# EAGLE design NinoTNC BLE (EAGLE 9.5.2)
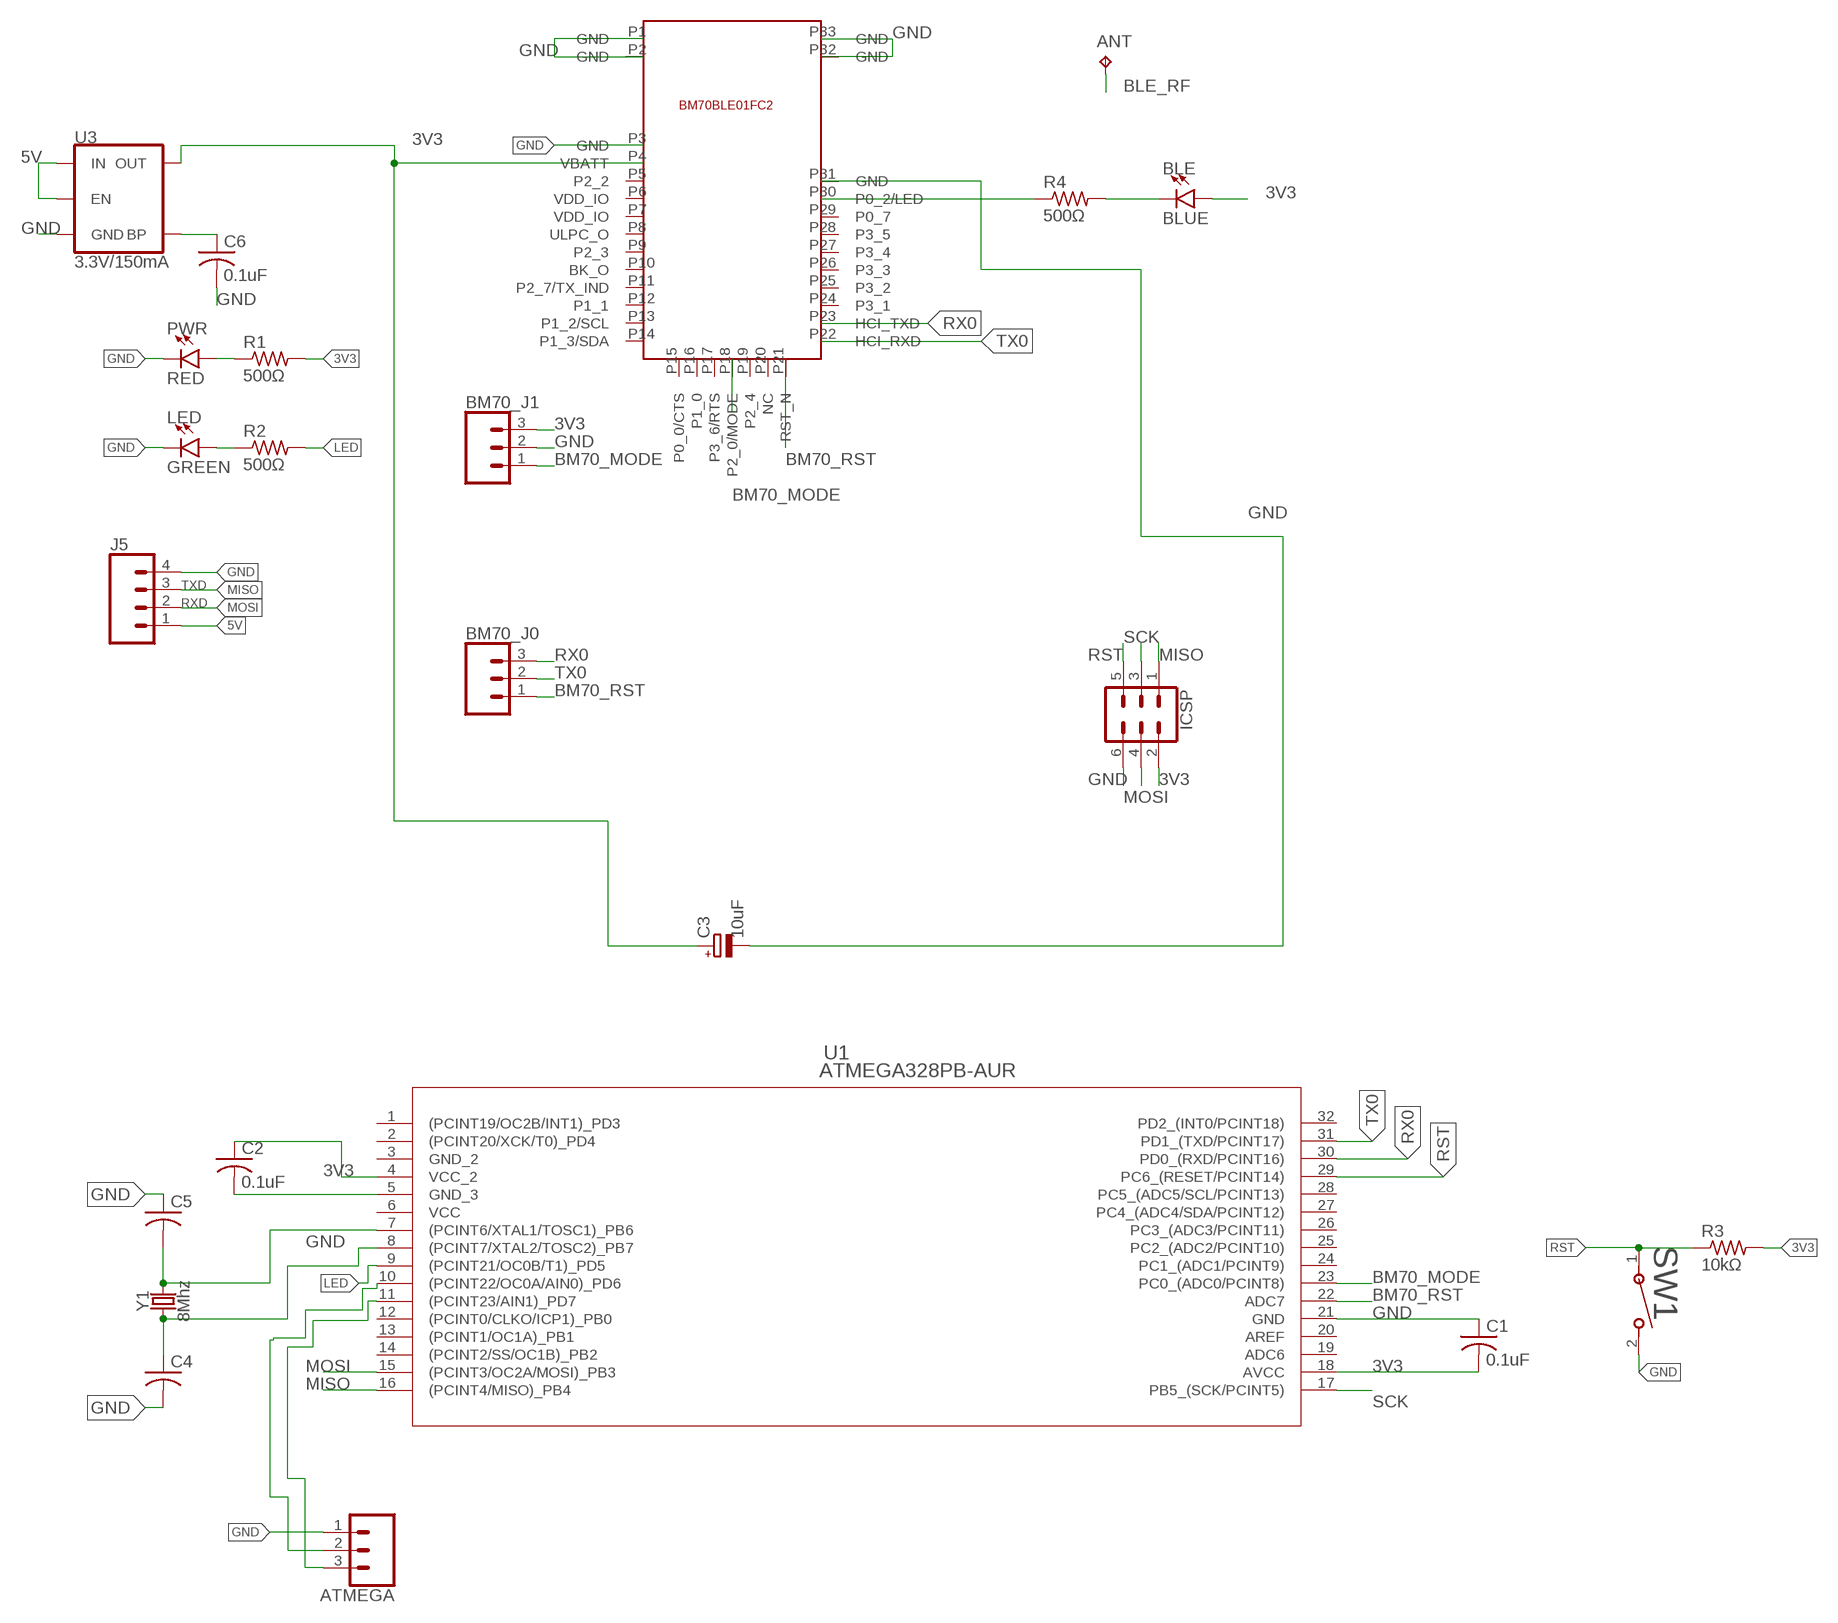
[diagram p0: schematic, sheet 1]

## Parts
ANT  TPTP08SQ  [TP08SQ]
ATMEGA  CONN_03  [1X03]
BLE  BLUE  LED-RED0603  [LED-0603]
BM70_J0  CONN_03  [1X03]
BM70_J1  CONN_03  [1X03]
C1  0.1uF  C-USC0805  [C0805]
C2  0.1uF  C-USC0805  [C0805]
C3  10uF  CAPACITOR_POL-SMC_A  [SMC_A]
C4  22pF  C-USC0805  [C0805]
C5  22pF  C-USC0805  [C0805]
C6  0.1uF  C-USC0805  [C0805]
ICSP  CONN_03X22X3_SILK_MALE_PTH  [2X3]
J5  CONN_04  [1X04]
LED  GREEN  LED-RED0603  [LED-0603]
PWR  RED  LED-RED0603  [LED-0603]
R1  500Ω  R-US_M0805  [M0805]
R2  500Ω  R-US_M0805  [M0805]
R3  10kΩ  R-US_R0805  [R0805]
R4  500Ω  R-US_M0805  [M0805]
SW1  EVQ-PE105K  [EVQPE_5_PAN]
U1  ATMEGA328PB-AUR  [32A_MCH]
U3  3.3V/150mA  V_REG_MIC52053.3V  [SOT23-5]
U$1  BM70BLE01FC2  [BM70BLE01FC2]
Y1  8Mhz  CRYSTALPTH-HC49UV  [HC49U]

## Nets
3V3: BLE.A BM70_J1.3 C1.2 C2.1 C3.+ ICSP.2 R1.2 R3.2 U1.4(VCC_2) U1.18(AVCC) U3.5(OUT) U$1.P4(VBATT)
5V: J5.1 U3.1(IN) U3.3(EN)
BLE_RF: ANT.TP
BM70_MODE: BM70_J1.1 U1.23(PC0_(ADC0/PCINT8)) U$1.P18(P2_0/MODE)
BM70_RST: BM70_J0.1 U1.22(ADC7) U$1.P21(RST_N)
GND: ATMEGA.1 BM70_J1.2 C1.1 C2.2 C3.- C4.2 C5.1 C6.2 ICSP.6 J5.4 LED.C PWR.C SW1.2 U1.5(GND_3) U1.21(GND) U3.2(GND) U$1.P1(GND) U$1.P2(GND) U$1.P3(GND) U$1.P31(GND) U$1.P32(GND) U$1.P33(GND)
LED: R2.2 U1.9((PCINT21/OC0B/T1)_PD5)
MISO: ICSP.1 J5.3 U1.16((PCINT4/MISO)_PB4)
MOSI: ICSP.4 J5.2 U1.15((PCINT3/OC2A/MOSI)_PB3)
N$1: R4.1 U$1.P30(P0_2/LED)
N$2: BLE.C R4.2
N$3: ATMEGA.3 U1.11((PCINT23/AIN1)_PD7)
N$4: C5.2 U1.7((PCINT6/XTAL1/TOSC1)_PB6) Y1.2
N$5: C4.1 U1.8((PCINT7/XTAL2/TOSC2)_PB7) Y1.1
N$6: PWR.A R1.1
N$7: LED.A R2.1
N$8: ATMEGA.2 U1.10((PCINT22/OC0A/AIN0)_PD6)
N$9: C6.1 U3.4(BP)
RST: ICSP.5 R3.1 SW1.1 U1.29(PC6_(RESET/PCINT14))
RX0: BM70_J0.3 U1.30(PD0_(RXD/PCINT16)) U$1.P23(HCI_TXD)
SCK: ICSP.3 U1.17(PB5_(SCK/PCINT5))
TX0: BM70_J0.2 U1.31(PD1_(TXD/PCINT17)) U$1.P22(HCI_RXD)
Unconnected: U1.1((PCINT19/OC2B/INT1)_PD3) U1.2((PCINT20/XCK/T0)_PD4) U1.12((PCINT0/CLKO/ICP1)_PB0) U1.13((PCINT1/OC1A)_PB1) U1.14((PCINT2/SS/OC1B)_PB2) U1.19(ADC6) U1.20(AREF) U1.24(PC1_(ADC1/PCINT9)) U1.25(PC2_(ADC2/PCINT10)) U1.26(PC3_(ADC3/PCINT11)) U1.27(PC4_(ADC4/SDA/PCINT12)) U1.28(PC5_(ADC5/SCL/PCINT13)) U1.32(PD2_(INT0/PCINT18)) U$1.P5(P2_2) U$1.P6(VDD_IO) U$1.P7(VDD_IO) U$1.P8(ULPC_O) U$1.P9(P2_3) U$1.P10(BK_O) U$1.P11(P2_7/TX_IND) U$1.P12(P1_1) U$1.P13(P1_2/SCL) U$1.P14(P1_3/SDA) U$1.P15(P0_0/CTS) U$1.P16(P1_0) U$1.P17(P3_6/RTS) U$1.P19(P2_4) U$1.P20(NC) U$1.P24(P3_1) U$1.P25(P3_2) U$1.P26(P3_3) U$1.P27(P3_4) U$1.P28(P3_5) U$1.P29(P0_7)

## Notes on the sheet
- TXD
- RXD

## Power pins joined to a net without a drawn wire
GND_2: U1.3(GND_2)
VCC: U1.6(VCC)

## Library data of the parts
ANT = testpad:TP: Test pad
ATMEGA BM70_J0 BM70_J1 = SparkFun-Connectors:CONN_03: Multi connection point. Often used as Generic Header-pin footprint for 0.1 inch spaced/style header connections On any of the 0.1 inch spaced packages, you can populate with these: Break Away Headers - Straight <https://www.sparkfun.com/products/116> (PRT-00116) Break Away Male Headers - Right Angle <https://www.sparkfun.com/products/553> (PRT-00553) Female Headers <https://www.sparkfun.com/products/115> (PRT-00115) Break Away Headers - Machine Pin <https://www.sparkfun.com/products/117> (PRT-00117) Break Away Female Headers - Swiss Machine Pin <https://www.sparkfun.com/products/743> (PRT-00743) Stackable Header - 3 Pin (Female, 0.1") <https://www.sparkfun.com/products/13875> (PRT-13875) For SCREWTERMINALS and SPRING TERMINALS visit here: Screw Terimnals on SparkFun.com <https://www.sparkfun.com/search/results?term=Screw+Terminals> (5mm/3.5mm/2.54mm spacing) This device is also useful as a general connection point to wire up your design to another part of your project. Our various solder wires solder well into these plated through hole pads. Hook-Up Wire - Assortment (Stranded, 22 AWG) <https://www.sparkfun.com/products/11375> (PRT-11375) Hook-Up Wire - Assortment (Solid Core, 22 AWG) <https://www.sparkfun.com/products/11367> (PRT-11367) View the entire wire category on our website here <https://www.sparkfun.com/categories/141> Special notes: Molex polarized connector foot print use with SKU : PRT-08232 with associated crimp pins and housings.
BLE LED = SparkFun-LED:LED-RED: Red SMD LED Used in manufacturing of most products at SparkFun Packages: 0603 - SMD 0603 package [Product Link] <http://docs.avagotech.com/docs/AV02-0551EN> 0603 SMART - SMD 0603 SMART package ( more efficient and expensive)[Product Link] <http://www.osram-os.com/Graphics/XPic2/00077099_0.pdf> 1206 - SMD1206 package [Product Link] <https://www.sparkfun.com/datasheets/DevTools/LilyPad/Q150OVS4.pdff> SparkFun Products: Pro Mini 328 -5V <https://www.sparkfun.com/products/821> RedBoard <https://www.sparkfun.com/products/12757> IOIO-OTG <https://www.sparkfun.com/products/13613>; PROD_ID: DIO-00819; VALUE: RED
C1 C2 C4-C6 = adafruit:C-US: CAPACITOR, American symbol
C3 = dp_devices:CAPACITOR_POL: Polarized capacitor in various packages
ICSP = SparkFun-Connectors:CONN_03X2: Multi connection point. Often used as Generic Header-pin footprint for 0.1 inch spaced/style header connections You can populate with any combo of single row headers, but if you'd like an exact match, check these: Header - 2x3 (Male, 0.1") <https://www.sparkfun.com/products/12807> (PRT-12807) Header - 2x3 (Female, 0.1") <https://www.sparkfun.com/products/13010> (PRT-13010) 2x3 Pin Shrouded Header <https://www.sparkfun.com/products/10877> (PRT-10877) On any of the 0.1 inch spaced packages, you can populate with these: Break Away Headers - Straight <https://www.sparkfun.com/products/116> (PRT-00116) Break Away Male Headers - Right Angle <https://www.sparkfun.com/products/553> (PRT-00553) Female Headers <https://www.sparkfun.com/products/115> (PRT-00115) Break Away Headers - Machine Pin <https://www.sparkfun.com/products/117> (PRT-00117) Break Away Female Headers - Swiss Machine Pin <https://www.sparkfun.com/products/743> (PRT-00743) Special note: the shrouded connector mates well with our 3x2 ribbon cables: Ribbon Crimp Connector - 6-pin (2x3, Female) <https://www.sparkfun.com/products/10651> (PRT-10651) Ribbon Cable - 6 wire (15ft) <https://www.sparkfun.com/products/10646> (PRT-10646); PROD_ID: CONN-09701
J5 = SparkFun-Connectors:CONN_04: Multi connection point. Often used as Generic Header-pin footprint for 0.1 inch spaced/style header connections On any of the 0.1 inch spaced packages, you can populate with these: Break Away Headers - Straight <https://www.sparkfun.com/products/116> (PRT-00116) Break Away Male Headers - Right Angle <https://www.sparkfun.com/products/553> (PRT-00553) Female Headers <https://www.sparkfun.com/products/115> (PRT-00115) Break Away Headers - Machine Pin <https://www.sparkfun.com/products/117> (PRT-00117) Break Away Female Headers - Swiss Machine Pin <https://www.sparkfun.com/products/743> (PRT-00743) For SCREWTERMINALS and SPRING TERMINALS visit here: Screw Terimnals on SparkFun.com <https://www.sparkfun.com/search/results?term=Screw+Terminals> (5mm/3.5mm/2.54mm spacing) This device is also useful as a general connection point to wire up your design to another part of your project. Our various solder wires solder well into these plated through hole pads. Hook-Up Wire - Assortment (Stranded, 22 AWG) <https://www.sparkfun.com/products/11375> (PRT-11375) Hook-Up Wire - Assortment (Solid Core, 22 AWG) <https://www.sparkfun.com/products/11367> (PRT-11367) View the entire wire category on our website here <https://www.sparkfun.com/categories/141> Special notes: Molex polarized connector foot print use with SKU : PRT-08231 with associated crimp pins and housings. 1MM SMD Version SKU: PRT-10208; PROD_ID: CONN-09696
PWR = SparkFun-LED:LED-RED: Red SMD LED Used in manufacturing of most products at SparkFun Packages: 0603 - SMD 0603 package [Product Link] <http://docs.avagotech.com/docs/AV02-0551EN> 0603 SMART - SMD 0603 SMART package ( more efficient and expensive)[Product Link] <http://www.osram-os.com/Graphics/XPic2/00077099_0.pdf> 1206 - SMD1206 package [Product Link] <https://www.sparkfun.com/datasheets/DevTools/LilyPad/Q150OVS4.pdff> SparkFun Products: Pro Mini 328 -5V <https://www.sparkfun.com/products/821> RedBoard <https://www.sparkfun.com/products/12757> IOIO-OTG <https://www.sparkfun.com/products/13613>; PROD_ID: DIO-00819
R1-R4 = adafruit:R-US_: RESISTOR, American symbol
SW1 = EVQ-PE105K:EVQ-PE105K; BUILT_BY: EMA_Cory; COPYRIGHT: Copyright (C) 2018 Accelerated Designs. All rights reserved; MANUFACTURER_PART_NUMBER: EVQ-PE105K; SOURCELIBRARY: Panasonic_2019-12-05; VENDOR: Panasonic
U1 = ATMEGA328PB-AUR:ATMEGA328PB-AUR; BUILT_BY: EMA_Molly; COPYRIGHT: Copyright (C) 2018 Accelerated Designs. All rights reserved; MANUFACTURER_PART_NUMBER: ATMEGA328PB-AUR; SOURCELIBRARY: Microchip_2019-09-03; VENDOR: Microchip
U3 = SparkFun-IC-Power:V_REG_MIC5205: V_REG MIC5205 Standard 3.3V, 5V, and Adjustable 150mA LDO voltage regulator in SOT-23 layout. Micrel part MIC5205. BP (by-pass) pin is used to lower output noise with 470pF cap, may be left open. On the adjustable version BP is used to set output.; PROD_ID: VREG-00822
U$1 = BM70:BM70BLE01FC2
Y1 = SparkFun-Clocks:CRYSTAL: Crystals (Generic) These are passive quartz crystals, which can be used as a clock source for a microcontroller. Crystal's are two-terminal devices. They require external "load" capacitors to generate an oscillating signal.

## Board
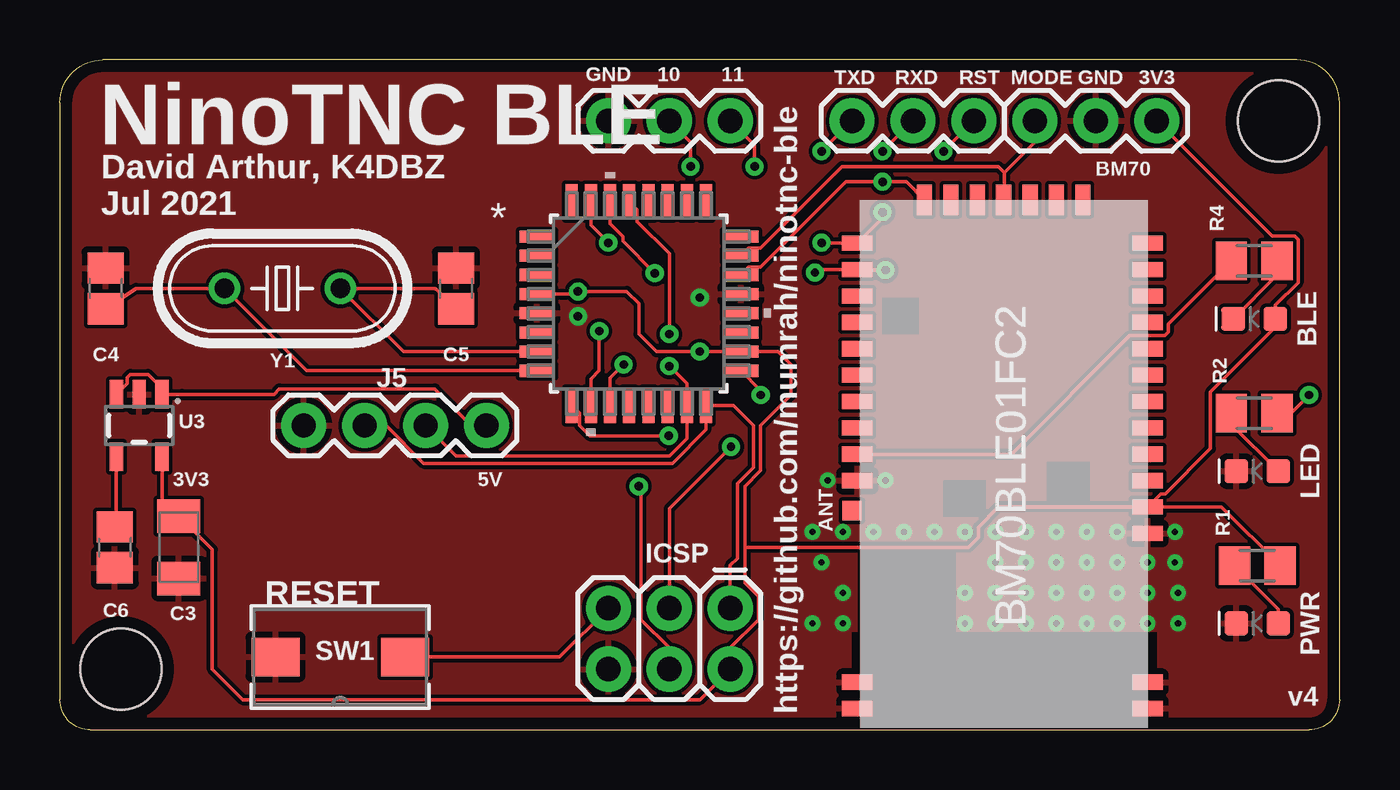
[diagram p1: board, top side]
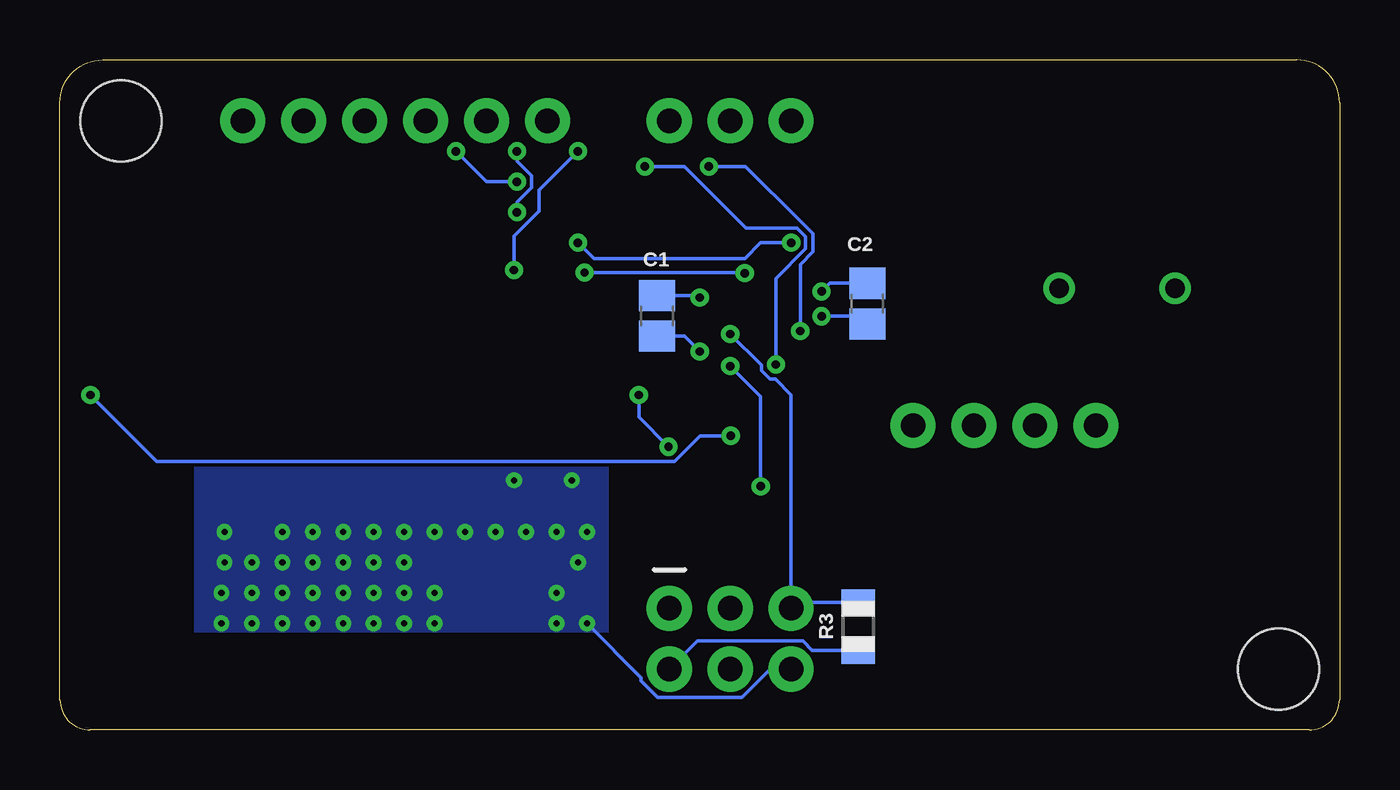
[diagram p2: board, bottom side, seen from below]

Size 53.34 x 27.94 mm. Coordinates in mm from the lower left corner, seen from the top.
Outline: 1.27,0 52.07,0 arc90 53.34,1.27 53.34,26.16 arc90 51.56,27.94 1.78,27.94 arc90 0,26.16 0,1.27 arc90 1.27,0
Copper layers (1*16): Top 0.035mm / dielectric 1.5mm / Bottom 0.035mm
Design rules "default *": minimum track width 6mil, minimum drill 10mil, track to track 6mil, track to pad 6mil, pad to pad 6mil, via to via 6mil, smd to smd 6mil, copper to edge 20mil, drill to drill 6mil, minimum pad ring 10mil, minimum via ring 8mil, stop-mask expansion 4mil, vias tented up to drill 20mil, thermal gap 10mil
Holes 3.38 mm at 2.54,2.54 50.8,25.4
tRestrict: area 33,0 to 45.7,4.1; area 33.3,4.1 to 37.3,7.4; area 36.8,8.9 to 38.6,10.4; area 41.1,9.4 to 42.9,11.2; area 34.3,16.5 to 35.8,18

### Footprints (pad centres in the part's own frame; a part is rotated, then mirrored left to right if it is on the bottom)
TP08SQ = smd 0.8 x 0.8: TP 0,0
1X03 = drill 1.016 pad 1.88: 1 0,0; 2 2.54,0; 3 5.08,0
LED-0603 = smd 1 x 1: A -0.877,0; C 0.877,0
C0805 = smd 1.3 x 1.5: 1 -0.85,0; 2 0.85,0
SMC_A = smd 1.4 x 1.8: + -1.3,0; - 1.3,0
2X3 = drill 1.016 pad 1.88: 1 0,0; 2 0,2.54; 3 2.54,0; 4 2.54,2.54; 5 5.08,0; 6 5.08,2.54
1X04 = drill 1.016 pad 1.88: 1 0,0; 2 2.54,0; 3 5.08,0; 4 7.62,0
M0805 = smd 1.3 x 1.6: 1 -0.95,0; 2 0.95,0
R0805 = smd 1.1 x 1.4: 1 -1,0; 2 1,0
EVQPE_5_PAN = smd 2.007 x 1.6: 1 -2.7,0; 2 2.7,0
32A_MCH = smd 1.461 x 0.501: 1 -4.25,2.8; 2 -4.25,2; 3 -4.25,1.2; 4 -4.25,0.4; 5 -4.25,-0.4; 6 -4.25,-1.2; 7 -4.25,-2; 8 -4.25,-2.8; 17 4.25,-2.8; 18 4.25,-2; 19 4.25,-1.2; 20 4.25,-0.4; 21 4.25,0.4; 22 4.25,1.2; 23 4.25,2; 24 4.25,2.8 | smd 0.501 x 1.461: 9 -2.8,-4.25; 10 -2,-4.25; 11 -1.2,-4.25; 12 -0.4,-4.25; 13 0.4,-4.25; 14 1.2,-4.25; 15 2,-4.25; 16 2.8,-4.25; 25 2.8,4.25; 26 2,4.25; 27 1.2,4.25; 28 0.4,4.25; 29 -0.4,4.25; 30 -1.2,4.25; 31 -2,4.25; 32 -2.8,4.25
SOT23-5 = smd 0.55 x 1.2: 1 -0.95,-1.3; 2 0,-1.3; 3 0.95,-1.3; 4 0.95,1.3; 5 -0.95,1.3
BM70BLE01FC2 = smd 1.27 x 0.635: P1 0,21.2; P2 0,20.1; P3 0,13.9; P4 0,12.8; P5 0,11.7; P6 0,10.6; P7 0,9.5; P8 0,8.4; P9 0,7.3; P10 0,6.2; P11 0,5.1; P12 0,4; P13 0,2.9; P14 0,1.8; P22 12.1,1.8; P23 12.1,2.9; P24 12.1,4; P25 12.1,5.1; P26 12.1,6.2; P27 12.1,7.3; P28 12.1,8.4; P29 12.1,9.5; P30 12.1,10.6; P31 12.1,11.7; P32 12.1,20.1; P33 12.1,21.2 | smd 0.635 x 1.27: P15 2.7,0; P16 3.8,0; P17 4.9,0; P18 6,0; P19 7.1,0; P20 8.2,0; P21 9.3,0
HC49U = drill 0.813: 1 -2.413,0; 2 2.413,0

### Placement (x,y rotation side)
ANT  33.02,9.14 0 top
ATMEGA  22.86,25.4 0 top
BLE  49.78,17.14 180 top
BM70_J0  38.1,25.4 180 top
BM70_J1  40.64,25.4 0 top
C1  28.45,17.27 270 bottom
C2  19.68,17.78 270 bottom
C3  4.95,7.62 270 top
C4  1.91,18.41 90 top
C5  16.51,18.41 270 top
C6  2.29,7.62 270 top
ICSP  27.94,5.08 180 top
J5  17.78,12.7 180 top
LED  49.91,10.79 180 top
PWR  49.91,4.45 180 top
R1  49.91,6.86 0 top
R2  49.78,13.21 0 top
R3  20.07,4.32 270 bottom
R4  49.78,19.56 0 top
SW1  11.68,3.05 180 top
U1  24.13,17.78 0 top
U3  3.3,12.7 180 top
U$1  45.34,22.1 180 top
Y1  9.27,18.41 0 top

### Tracks (layer width: path | path; a pad name or v marks a point on that pad's centre or on a via)
3V3  (via drill 0.35)
  Top 0.152: U1.4 21.48,18.18 v21.59,18.29 23.62,18.29 24.13,17.78 24.13,16.51 24.86,15.78 v26.67,15.78 U1.18 29.94,15.78 30.48,15.24 30.48,13.97 29.21,12.7 29.21,10.82 28.55,10.16 28.55,7.62 | 28.55,7.62 28.55,6.13 29.11,5.56 29.11,4.6 27.94,3.43 ICSP.2 26.67,1.27 7.62,1.27 6.35,2.54 6.35,7.52 C3.+ 4.25,9.62 U3.5 | U$1.P4 39.12,9.3 38.28,8.45 38.28,8.02 37.87,7.62 28.55,7.62 | U$1.P4 45.89,9.85 46.07,9.85 47.95,11.74 47.95,14.1 50.66,16.81 BLE.A 50.66,17.71 51.61,18.66 51.61,20.45 51.48,20.59 50.53,20.59 BM70_J1.3 | U$1.P4 48.42,9.3 R1.2
  Bottom 0.152: v21.59,18.29 21.25,18.63 C2.1 | C1.2 27.31,16.42 v26.67,15.78 | R3.2 21.99,3.32 22.38,3.71 26.77,3.71 ICSP.2
5V
  Top 0.152: J5.1 17.14,12.7 15.62,14.22 9.14,14.22 8.92,14 5.08,14 4.5,14 | U3.1 4.5,14 | U3.3 2.8,14.45 2.8,14.7 2.93,14.83 3.67,14.83 4.5,14
BM70_MODE
  Top 0.152: U1.23 28.7,20.1 29.2,20.1 32.6,23.5 39.12,23.5 39.37,23.24 | 39.37,23.24 39.37,22.13 U$1.P18 | BM70_J1.1 40.64,24.51 39.37,23.24
BM70_RST  (via drill 0.35)
  Top 0.152: U$1.P21 35.28,22.86 v34.29,22.86 32.76,22.86 29.2,19.3 28.7,19.3 U1.22 | v36.83,24.13 BM70_J0.1
  Bottom 0.152: v36.83,24.13 35.56,22.86 v34.29,22.86
GND  (via drill 0.25, 0.35)
  Bottom 0.152: C2.2 20.01,17.25 v21.59,17.25 | C1.1 26.76,18.12 v26.67,18.03 | ICSP.6 23.75,2.54 24.92,1.37 28.42,1.37 29.11,2.06 29.11,2.18 v31.37,4.45
  other vias: 37.72,4.45 38.99,4.45 40.26,4.45 41.53,4.45 42.8,4.45 44.07,4.45 45.34,4.45 46.61,4.45 45.34,5.71 46.61,5.71 32.64,4.45 44.07,5.71 42.8,5.71 41.53,5.71 40.26,5.71 38.99,5.71 37.72,5.71 38.99,6.99 40.26,6.99 41.53,6.99 42.8,6.99 44.07,6.99 45.34,6.99 44.07,8.26 42.8,8.26 41.53,8.26 40.26,8.26 38.99,8.26 37.72,8.26 36.45,8.26 35.18,8.26 33.91,8.26 32.64,8.26 32.64,5.71 31.37,8.26 34.42,10.41 32,10.41 46.48,8.26 46.48,6.99 31.75,6.99
  pour Top: -1.27,29.21 -1.27,-1.27 53.34,-1.27 53.34,29.21
  pour Bottom: 30.48,11.43 47.75,11.43 47.75,4.06 30.48,4.06
LED  (via drill 0.35)
  Top 0.152: U1.9 21.65,13.21 21.65,12.71 22.09,12.27 v25.38,12.27 | v52.07,13.97 51.31,13.21 R2.2
  Bottom 0.152: v25.38,12.27 26.66,12.27 27.72,11.2 49.3,11.2 v52.07,13.97
MISO
  Top 0.152: J5.3 13.59,12.7 15.16,11.12 25.53,11.12 26.93,12.53 U1.16 28.07,13.53 28.91,12.7 28.91,10.95 28.24,10.29 28.24,7.16 27.94,6.86 ICSP.1
MOSI  (via drill 0.35)
  Top 0.152: J5.2 16.51,11.43 25.4,11.43 26.13,12.16 U1.15 26.13,14.44 v25.4,15.17 | ICSP.4 25.4,3.43 24.23,4.6 24.23,10.06 v24.13,10.16
  Bottom 0.152: v24.13,10.16 24.13,13.9 v25.4,15.17
N$1
  Top 0.152: R4.1 46.2,16.93 46.2,16.59 46.06,16.44 44.61,16.44 39.66,11.5 U$1.P30
N$2
  Top 0.152: BLE.C 50.73,18.97 R4.2
N$3  (via drill 0.35)
  Top 0.152: U1.11 22.93,14.68 v23.5,15.24 | ATMEGA.3 28.96,24.38 v28.96,23.5
  Bottom 0.152: v23.5,15.24 23.5,18.83 22.25,20.07 22.25,20.57 22.61,20.93 24.74,20.93 27.3,23.5 v28.96,23.5
N$4
  Top 0.152: U1.7 14.32,15.78 Y1.2 15.64,18.41 15.66,18.39 15.69,18.39 C5.2
N$5
  Top 0.152: C4.1 3.17,18.41 Y1.1 10.29,14.98 U1.8
N$6
  Top 0.152: PWR.A 50.79,5.03 R1.1
N$7
  Top 0.152: LED.A 48.83,12.75 R2.1
N$8  (via drill 0.35)
  Top 0.152: U1.10 22.13,14.64 22.48,14.99 v22.48,16.64 | ATMEGA.2 26.29,24.51 v26.29,23.5
  Bottom 0.152: v22.48,16.64 22.48,19.41 21.95,19.94 21.95,20.7 22.48,21.23 22.5,21.23 24.77,23.5 v26.29,23.5
N$9
  Top 0.152: U3.4 2.35,8.54 C6.1
RST  (via drill 0.35)
  Top 0.152: U1.29 24.05,21.71 24.05,21.2 25.4,19.86 v25.4,16.51 | SW1.1 20.83,3.05 ICSP.5
  Bottom 0.152: v25.4,16.51 24.1,15.21 24.1,14.99 23.75,14.63 23.52,14.63 22.86,13.97 ICSP.5 22.62,5.32 R3.1
RX0  (via drill 0.35)
  Top 0.152: v31.75,24.13 BM70_J0.3 | U$1.P23 33.02,19.2 | 33.02,19.2 31.59,19.2 v31.47,19.07 | v24.79,19.05 23.47,20.38 23.47,20.57 22.93,21.11 U1.30 | v34.42,19.18 33.04,19.18 33.02,19.2
  Bottom 0.152: v31.47,19.07 24.82,19.07 v24.79,19.05 | v31.75,24.13 33.38,22.5 33.38,21.64 34.42,20.61 v34.42,19.18
SCK  (via drill 0.35)
  Top 0.152: ICSP.3 25.4,9.24 v27.97,11.81 | v29.21,13.97 29.21,14.15 U1.17
  Bottom 0.152: v27.97,11.81 29.21,13.05 v29.21,13.97
TX0  (via drill 0.35)
  Top 0.152: U1.31 22.13,21.05 v22.86,20.32 | v34.29,24.13 BM70_J0.2 | v31.75,20.32 31.77,20.3 U$1.P22 34.29,21.35 v34.29,21.59
  Bottom 0.152: v31.75,20.32 31.09,19.66 24.79,19.66 24.13,20.32 v22.86,20.32 | v34.29,24.13 34.29,23.72 33.68,23.11 33.68,22.61 34.29,22 v34.29,21.59

### Text on the board
tNames: GND | 10 | 11 | TXD | RXD | RST | MODE | GND | 3V3 | NinoTNC BLE | BM70 | David Arthur, K4DBZ / Jul 2021 | 3V3 | 5V | RESET | https://github.com/mumrah/ninotnc-ble | v4